# EAGLE schematic kossel_mini_extruder (EAGLE 6.5.0)
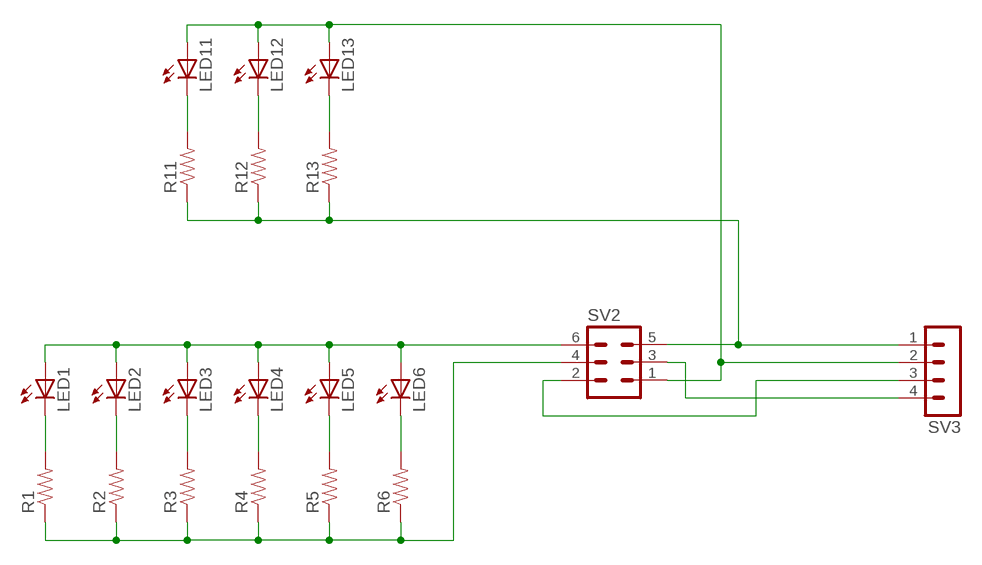
[diagram p0: schematic, sheet 1]

## Parts
LED1  LED0805  [CHIPLED_0805]
LED2  LED0805  [CHIPLED_0805]
LED3  LED0805  [CHIPLED_0805]
LED4  LED0805  [CHIPLED_0805]
LED5  LED0805  [CHIPLED_0805]
LED6  LED0805  [CHIPLED_0805]
LED11  LED0805  [CHIPLED_0805]
LED12  LED0805  [CHIPLED_0805]
LED13  LED0805  [CHIPLED_0805]
R1  RESISTOR0805-RES  [0805]
R2  RESISTOR0805-RES  [0805]
R3  RESISTOR0805-RES  [0805]
R4  RESISTOR0805-RES  [0805]
R5  RESISTOR0805-RES  [0805]
R6  RESISTOR0805-RES  [0805]
R11  RESISTOR0805-RES  [0805]
R12  RESISTOR0805-RES  [0805]
R13  RESISTOR0805-RES  [0805]
SV2  MA03-2  [MA03-2]
SV3  MA04-1  [MA04-1]

## Nets
GND: R1.1 R2.1 R3.1 R4.1 R5.1 R6.1 SV2.4
HOT_12V: R11.1 R12.1 R13.1 SV2.5 SV3.1
HOT_SIG: LED11.A LED12.A LED13.A SV2.1 SV3.2
N$1: LED1.C R1.2
N$2: LED2.C R2.2
N$3: LED3.C R3.2
N$4: LED4.C R4.2
N$5: LED5.C R5.2
N$6: LED6.C R6.2
N$16: LED11.C R11.2
N$17: LED12.C R12.2
N$18: LED13.C R13.2
THERM_GND: SV2.3 SV3.4
THERM_SIG: SV2.2 SV3.3
VCC: LED1.A LED2.A LED3.A LED4.A LED5.A LED6.A SV2.6

## Library data of the parts
LED1-LED6 LED11-LED13 = SparkFun-LED:LED: LEDs Standard schematic elements and footprints for 5mm, 3mm, 1206, and 0603 sized LEDs. 5mm - Spark Fun Electronics SKU : COM-00529 (and others)
R1-R6 R11-R13 = SparkFun-Passives:RESISTOR: Resistor Basic schematic elements and footprints for 0603, 1206, and PTH resistors.
SV2 = con-lstb:MA03-2: PIN HEADER; OC_FARNELL: unknown; OC_NEWARK: unknown
SV3 = con-lstb:MA04-1: PIN HEADER; OC_FARNELL: unknown; OC_NEWARK: unknown

## Net classes
0 default: width 0.203 mm, drill 0.305 mm, clearance 0.203 mm
1 high current: width 0.762 mm, drill 0.457 mm, clearance 0.203 mm